# Altium schematic sheet 07 - USB Interface.SchDoc: USB Interface
size A3; Date:: 0; Page Number: 7; Page Size: B; Page Count: 12; Board Rev: B; Project Name: CrossLink-NX Evaluation Board; RevCode: 1.0; Doc: 305-PD-19-0819; DsnPath: C:\Users\HAltinkilit\Downloads\Crosslink-NX-Design-Files\CrossLink-NX-Eval-Brd-Schematic-RevB-191122.DSN; SchematicName: SCHEMATIC1; PageName: 03 - USB Interface; PageSize: B; TopSchematic: True
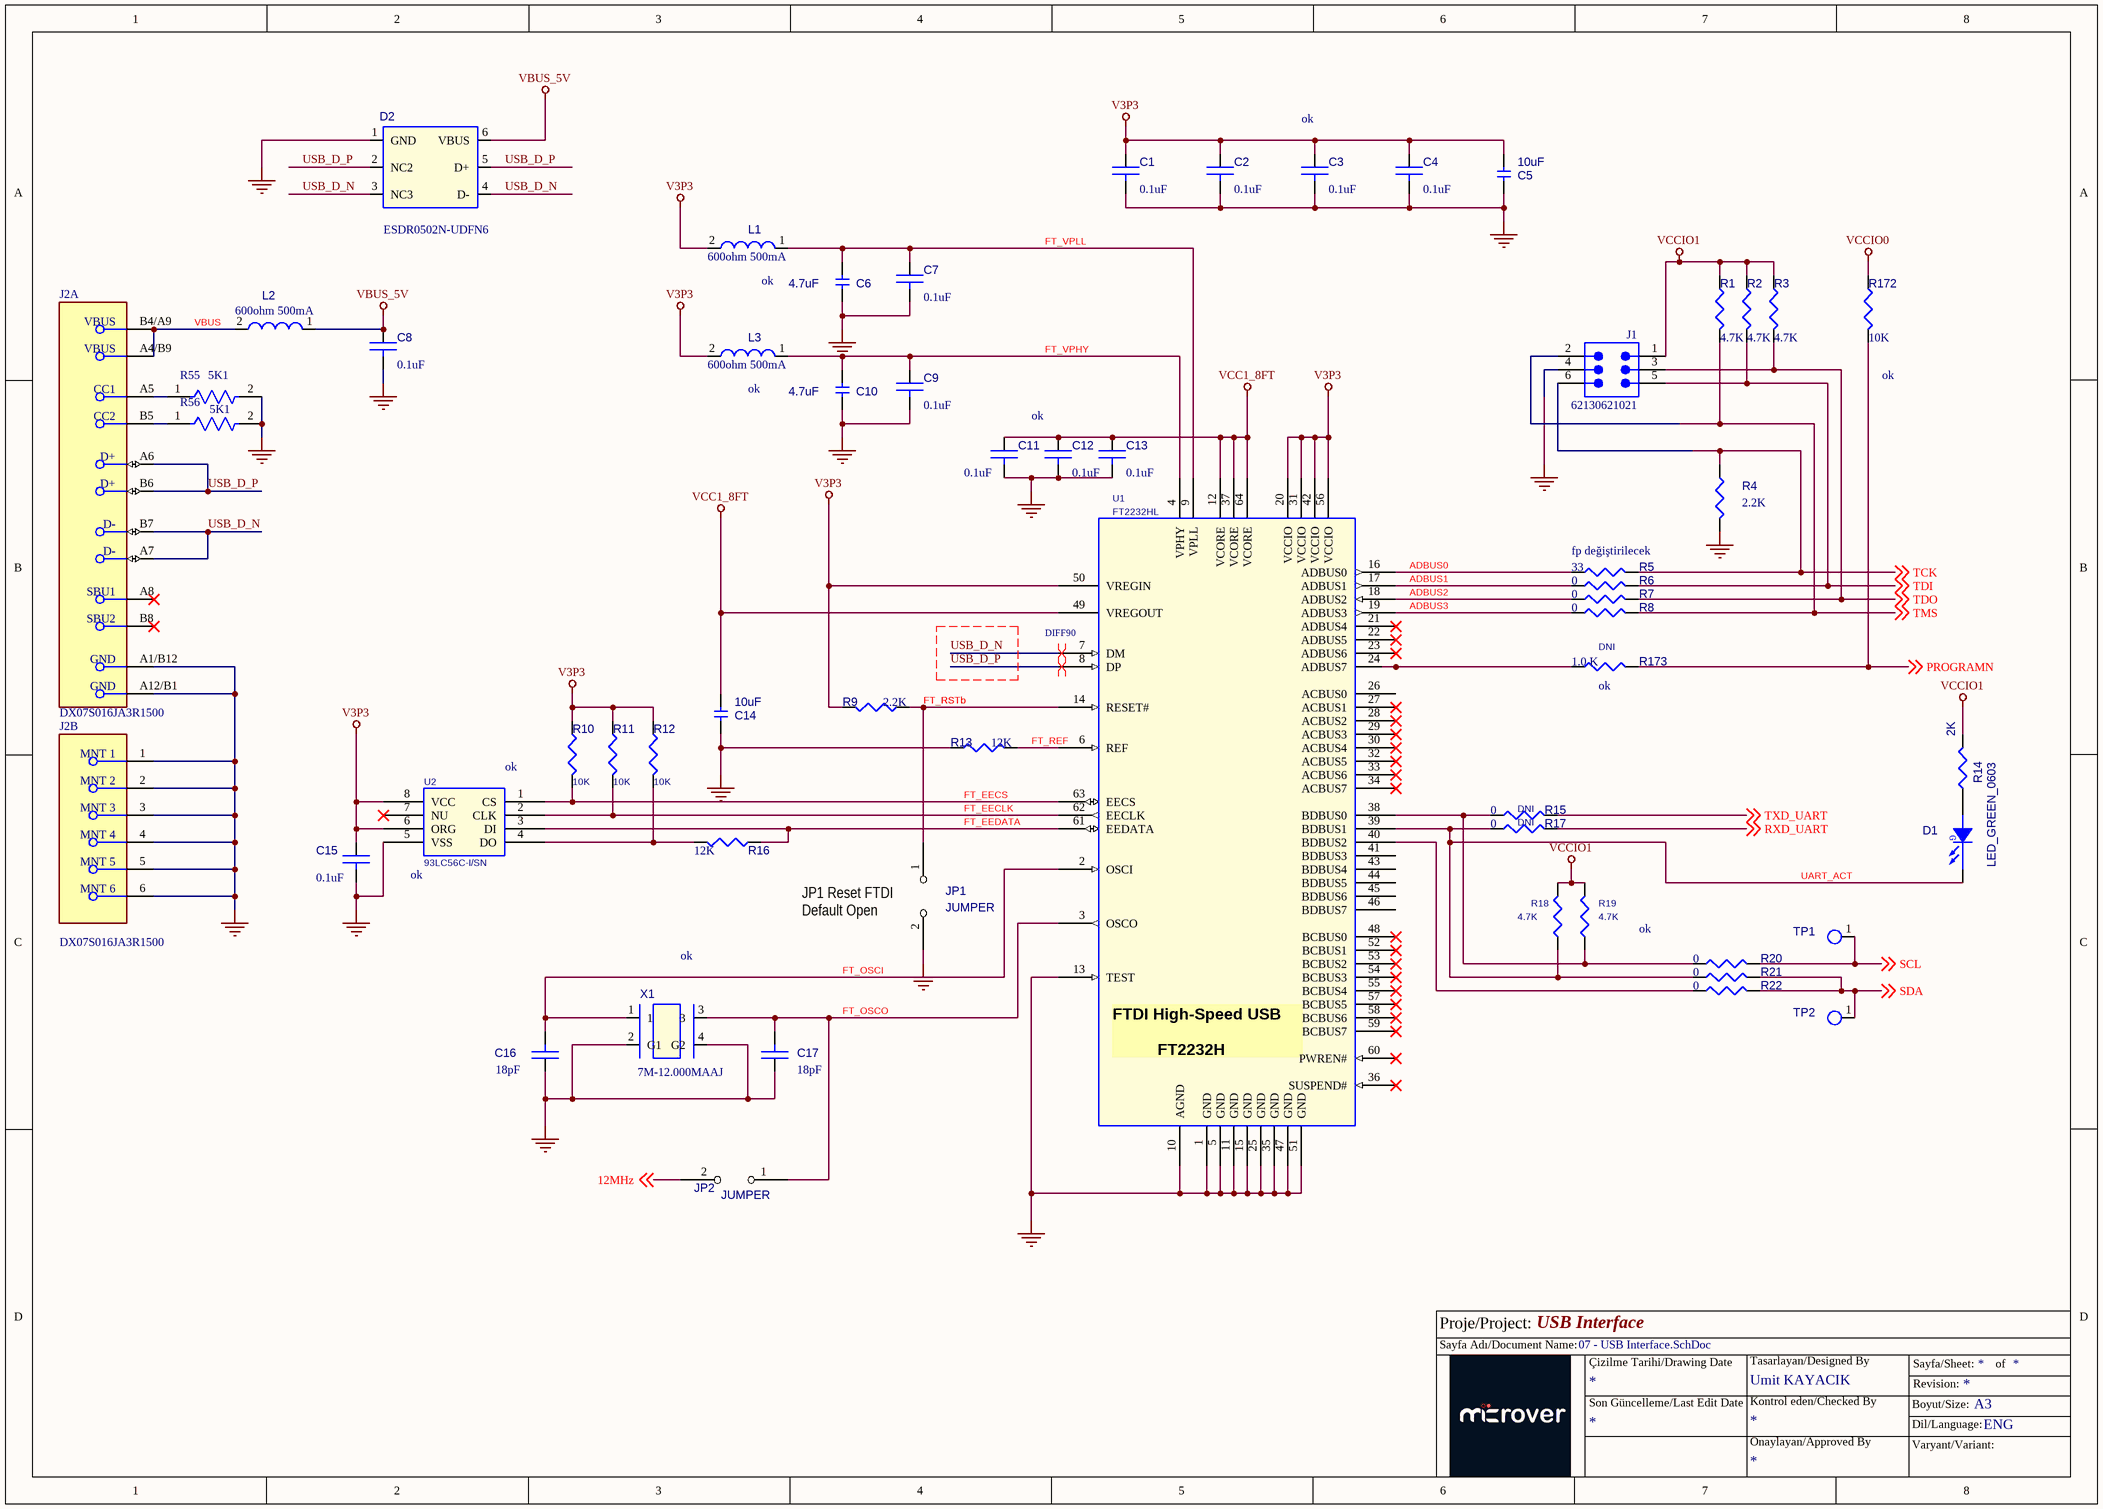
[diagram p0: 07 - USB Interface.SchDoc]

## Parts
C1  0.1uF  [C0201]
C2  0.1uF  [C0201]
C3  0.1uF  [C0201]
C4  0.1uF  [C0201]
C5  10uF  [C0603]
C6  4.7uF  [C0603]
C7  0.1uF  [C0201]
C8  0.1uF  [C0402]
C9  0.1uF  [C0201]
C10  4.7uF  [C0603]
C11  0.1uF  [C0201]
C12  0.1uF  [C0201]
C13  0.1uF  [c0201]
C14  10uF  [C0603]
C15  0.1uF  [C0201]
C16  18pF  [C0402]
C17  18pF  [C0402]
D1  LED_GREEN_0603  [APT1608]
D2  ESDR0502N-UDFN6  [UDFN6_040]
J1  62130621021  [62130621021]
J2  DX07S016JA3R1500  [FP-DX07S016JA3R1500-MFG]  (parts A,B of 2)
JP1  JUMPER  [R0603]
JP2  JUMPER  [0603]
L1  600ohm 500mA  [FB0603]
L2  600ohm 500mA  [FB0603]
L3  600ohm 500mA  [FB0603]
R1  4.7K  [R0603]
R2  4.7K  [R0603]
R3  4.7K  [R0603]
R4  2.2K  [R0603]
R5  33  [R0402]
R6  0  [R0603]
R7  0  [R0603]
R8  0  [R0603]
R9  2.2K  [R0603]
R10  10K  [R0603]
R11  10K  [R0603]
R12  10K  [R0603]
R13  12K  [R0603]
R14  2K  [R0402]
R15  0  Assy: DNI  [R0603]
R16  12K  [R0603]
R17  0  Assy: DNI  [R0603]
R18  4.7K  [RLP-101]
R19  4.7K  [RLP-101]
R20  0  [R0603]
R21  0  [R0603]
R22  0  [R0603]
R55  5K1  [FP-CR0402-IPC_A]
R56  5K1  [FP-CR0402-IPC_A]
R172  10K  [R0603]
R173  1.0 K  Assy: DNI  [R0603]
TP1  TP_S_40_63  [TP_1MM]  (value not drawn)
TP2  TP_S_40_63  [TP_1MM]  (value not drawn)
U1  FT2232HL  [tqfp64_0p5_12p2x12p2_h1p6]
U2  93LC56C-I/SN  [so8_50_244]
X1  7M-12.000MAAJ  [xtal_4p_7m]

## Nets
GND: C1.2 C2.2 C3.2 C4.2 C5.1 C6.1 C7.2 C8.2 C9.2 C10.1 C11.2 C12.2 C13.2 C14.1 C15.2 C16.1 C17.1 D2.1(GND) J1.4 J2.1(MNT_1) J2.2(MNT_2) J2.3(MNT_3) J2.4(MNT_4) J2.5(MNT_5) J2.6(MNT_6) J2.A1/B12(GND) J2.A12/B1(GND) JP1.2 R4.2 R13.1 R55.2 R56.2 U1.1(GND) U1.5(GND) U1.10(AGND) U1.11(GND) U1.13(TEST) U1.15(GND) U1.25(GND) U1.35(GND) U1.47(GND) U1.51(GND) U2.5(VSS) X1.2(G1) X1.4(G2)
V3P3: C1.1 C2.1 C3.1 C4.1 C5.2 C15.1 L1.2 L3.2 R9.2 R10.1 R11.1 R12.1 U1.20(VCCIO) U1.31(VCCIO) U1.42(VCCIO) U1.50(VREGIN) U1.56(VCCIO) U2.6(ORG) U2.8(VCC)
VBUS_5V: C8.1 D2.6(VBUS) L2.1
VCC1_8FT: C11.1 C12.1 C13.1 C14.2 U1.12(VCORE) U1.37(VCORE) U1.49(VREGOUT) U1.64(VCORE)
VCCIO0: R172.1
VCCIO1: J1.1 R1.1 R2.1 R3.1 R14.2 R18.2 R19.2
12MHz: JP2.2 ; off-sheet 12MHz
ADBUS0: R5.1 U1.16(ADBUS0)
ADBUS1: R6.1 U1.17(ADBUS1)
ADBUS2: R7.1 U1.18(ADBUS2)
ADBUS3: R8.1 U1.19(ADBUS3)
FT_EECLK: R11.2 U1.62(EECLK) U2.2(CLK)
FT_EECS: R10.2 U1.63(EECS) U2.1(CS)
FT_EEDATA: R16.1 U1.61(EEDATA) U2.3(DI)
FT_OSCI: C16.2 U1.2(OSCI) X1.1
FT_OSCO: C17.2 JP2.1 U1.3(OSCO) X1.3
FT_REF: R13.2 U1.6(REF)
FT_RSTb: JP1.1 R9.1 U1.14(RESET#)
FT_VPHY: C9.1 C10.2 L3.1 U1.4(VPHY)
FT_VPLL: C6.2 C7.1 L1.1 U1.9(VPLL)
PROGRAMN: R172.2 R173.2 ; off-sheet PROGRAMN
RXD_UART: R17.2 ; off-sheet RXD_UART
SCL: R20.2 TP1.1(TP) ; off-sheet SCL
SDA: R21.2 R22.2 TP2.1(TP) ; off-sheet SDA
TCK: J1.6 R4.1 R5.2 ; off-sheet TCK
TDI: J1.5 R2.2 R6.2 ; off-sheet TDI
TDO: J1.3 R3.2 R7.2 ; off-sheet TDO
TMS: J1.2 R1.2 R8.2 ; off-sheet TMS
TXD_UART: R15.2 ; off-sheet TXD_UART
UART_ACT: D1.1(CATHODE) R17.1 R18.1 R21.1 U1.39(BDBUS1)
USB_D_N: D2.3(NC3) D2.4(D-) J2.A7(D-) J2.B7(D-) U1.7(DM)
USB_D_P: D2.2(NC2) D2.5(D+) J2.A6(D+) J2.B6(D+) U1.8(DP)
VBUS: J2.A4/B9(VBUS) J2.B4/A9(VBUS) L2.2
NetD1_2: D1.2(ANODE) R14.1
NetJ2_A5: J2.A5(CC1) R55.1
NetJ2_B5: J2.B5(CC2) R56.1
NetR12_2: R12.2 R16.2 U2.4(DO)
NetR15_1: R15.1 R19.1 R20.1 U1.38(BDBUS0)
NetR22_1: R22.1 U1.40(BDBUS2)
NetR173_1: R173.1 U1.24(ADBUS7)

Not connected (* = marked no-connect by the designer): J2 A8(SBU1)* B8(SBU2)*; U1 21(ADBUS4)* 22(ADBUS5)* 23(ADBUS6)* 26(ACBUS0) 27(ACBUS1)* 28(ACBUS2)* 29(ACBUS3)* 30(ACBUS4)* 32(ACBUS5)* 33(ACBUS6)* 34(ACBUS7)* 36(SUSPEND#)* 41(BDBUS3) 43(BDBUS4) 44(BDBUS5) 45(BDBUS6) 46(BDBUS7) 48(BCBUS0)* 52(BCBUS1)* 53(BCBUS2)* 54(BCBUS3)* 55(BCBUS4)* 57(BCBUS5)* 58(BCBUS6)* 59(BCBUS7)* 60(PWREN#)*; U2 7(NU)*

## Layout directives
differential pair; differential pair class DIFF90: USB_D_N, USB_D_P

## Notes on the sheet
- (near C3) ok
- (near L1) ok
- (near R172) ok
- (near L3) ok
- ok
- (near R5) fp değiştirilecek
- (near R173) ok
- (near U2) ok
- (near JP1) JP1 Reset FTDI
  Default Open
- Proje/Project:
- Sayfa Adı/Document Name:
- Çizilme Tarihi/Drawing Date
- Umit KAYACIK
- Tasarlayan/Designed By
- Sayfa/Sheet:
- Revision:
- of
- Son Güncelleme/Last Edit Date
- Kontrol eden/Checked By
- Onaylayan/Approved By
- Boyut/Size:
- Varyant/Variant:
- Dil/Language:
- A3
- ENG
- (in symbol FT2232HL) FTDI High-Speed USB / FT2232H
- (in symbol LED-SMT1206_GREEN_1) G

## Library data of the parts
C1 = 0u1_0402: CAP CER 0.1UF 25V 10% X5R 0201; Manufacturer: Murata; Manufacturer Part Number: GRM033R61E104KE14J; Part Reference: C1; Class: Discrete; Digikey P/N: 399-3521-2-ND; Assy: -; Value: 0.1uF; PCB Footprint: C0201
C2 = 0u1_0402: CAP CER 0.1UF 25V 10% X5R 0201; Manufacturer: Murata; Manufacturer Part Number: GRM033R61E104KE14J; Part Reference: C2; Class: Discrete; Digikey P/N: 399-3521-2-ND; Assy: -; Value: 0.1uF; PCB Footprint: C0201
C3 = 0u1_0402: CAP CER 0.1UF 25V 10% X5R 0201; Manufacturer: Murata; Manufacturer Part Number: GRM033R61E104KE14J; Part Reference: C3; Class: Discrete; Digikey P/N: 399-3521-2-ND; Assy: -; Value: 0.1uF; PCB Footprint: C0201
C4 = 0u1_0402: CAP CER 0.1UF 25V 10% X5R 0201; Manufacturer: Murata; Manufacturer Part Number: GRM033R61E104KE14J; Part Reference: C4; Class: Discrete; Digikey P/N: 399-3521-2-ND; Assy: -; Value: 0.1uF; PCB Footprint: C0201
C5 = C: Part Reference: C5; DIST: FLAT; PSpiceTemplate: C^@REFDES %1 %2 ?TOLERANCE|C^@REFDES| @VALUE ?IC/IC=@IC/ ?TOLERANCE|\n.model C^@REFDES CAP C=1 DEV=@TOLERANCE%|; VOLTAGE: CMAX; CURRENT: CIMAX; KNEE: CBMAX; SLOPE: CSMAX; MAX_TEMP: CTMAX; Populate: <Populate>; Value: 10uF; Assy: -; PCB Footprint: C0603
C6 = C: Part Reference: C6; DIST: FLAT; PSpiceTemplate: C^@REFDES %1 %2 ?TOLERANCE|C^@REFDES| @VALUE ?IC/IC=@IC/ ?TOLERANCE|\n.model C^@REFDES CAP C=1 DEV=@TOLERANCE%|; VOLTAGE: CMAX; CURRENT: CIMAX; KNEE: CBMAX; SLOPE: CSMAX; MAX_TEMP: CTMAX; Populate: <Populate>; Value: 4.7uF; Assy: -; PCB Footprint: C0603
C7 = 0u1_0402: CAP CER 0.1UF 25V 10% X5R 0201; Manufacturer: Murata; Manufacturer Part Number: GRM033R61E104KE14J; Part Reference: C7; Class: Discrete; Digikey P/N: 399-3521-2-ND; Assy: -; Value: 0.1uF; PCB Footprint: C0201
C8 = 0u1_0402: CAP CER 0.1UF 25V 10% X5R 0201; Manufacturer: Murata; Manufacturer Part Number: GRM033R61E104KE14J; Part Reference: C8; Class: Discrete; PCB Footprint: C0201; Digikey P/N: 399-3521-2-ND; Assy: -; Value: 0.1uF
C9 = 0u1_0402: CAP CER 0.1UF 25V 10% X5R 0201; Manufacturer: Murata; Manufacturer Part Number: GRM033R61E104KE14J; Part Reference: C9; Class: Discrete; Digikey P/N: 399-3521-2-ND; Assy: -; Value: 0.1uF; PCB Footprint: C0201
C10 = C: Part Reference: C10; DIST: FLAT; PSpiceTemplate: C^@REFDES %1 %2 ?TOLERANCE|C^@REFDES| @VALUE ?IC/IC=@IC/ ?TOLERANCE|\n.model C^@REFDES CAP C=1 DEV=@TOLERANCE%|; VOLTAGE: CMAX; CURRENT: CIMAX; KNEE: CBMAX; SLOPE: CSMAX; MAX_TEMP: CTMAX; Populate: <Populate>; Value: 4.7uF; Assy: -; PCB Footprint: C0603
C11 = 0u1_0402: CAP CER 0.1UF 25V 10% X5R 0201; Manufacturer: Murata; Manufacturer Part Number: GRM033R61E104KE14J; Part Reference: C11; Class: Discrete; Digikey P/N: 399-3521-2-ND; Assy: -; Value: 0.1uF; PCB Footprint: C0201
C12 = 0u1_0402: CAP CER 0.1UF 25V 10% X5R 0201; Manufacturer: Murata; Manufacturer Part Number: GRM033R61E104KE14J; Part Reference: C12; Class: Discrete; Digikey P/N: 399-3521-2-ND; Assy: -; Value: 0.1uF; PCB Footprint: C0201
C13 = 0u1_0402: CAP CER 0.1UF 25V 10% X5R 0201; Manufacturer: Murata; Manufacturer Part Number: GRM033R61E104KE14J; Part Reference: C13; Class: Discrete; Digikey P/N: 399-3521-2-ND; Assy: -; Value: 0.1uF; PCB Footprint: C0201
C14 = C: Part Reference: C14; DIST: FLAT; PSpiceTemplate: C^@REFDES %1 %2 ?TOLERANCE|C^@REFDES| @VALUE ?IC/IC=@IC/ ?TOLERANCE|\n.model C^@REFDES CAP C=1 DEV=@TOLERANCE%|; VOLTAGE: CMAX; CURRENT: CIMAX; KNEE: CBMAX; SLOPE: CSMAX; MAX_TEMP: CTMAX; Populate: <Populate>; Value: 10uF; Assy: -; PCB Footprint: C0603
C15 = 0u1_0402: CAP CER 0.1UF 25V 10% X5R 0201; Manufacturer: Murata; Manufacturer Part Number: GRM033R61E104KE14J; Part Reference: C15; Class: Discrete; Digikey P/N: 399-3521-2-ND; Assy: -; Value: 0.1uF; PCB Footprint: C0201
C16 = 0u1_0402: CAP CER 18PF 25V 10% NP0 0402; Manufacturer: Kemet; Manufacturer Part Number: C0402C180K3GACTU; Part Reference: C16; Class: Discrete; Digikey P/N: C0402C180K3GACTU-ND; Assy: -; Value: 18pF; PCB Footprint: C0402
C17 = 0u1_0402: CAP CER 18PF 25V 10% NP0 0402; Manufacturer: Kemet; Manufacturer Part Number: C0402C180K3GACTU; Part Reference: C17; Class: Discrete; Digikey P/N: C0402C180K3GACTU-ND; Assy: -; Value: 18pF; PCB Footprint: C0402
D1 = LED-SMT1206_GREEN_1: Part Reference: D1; Value: LED_GREEN_0603; PCB Footprint: APT1608; Assy: -
D2 = ESDR0502: ESD Protection - SLP2510P8 package 8-PIN; Part Reference: D2; ALS LIB: L0000; CLASS: IC; Vendor: Digikey; MFG: Semtech; MFG P/N: RClamp0524P; Vendor P/N: RCLAMP0524PTR-ND; Value: ESDR0502N-UDFN6; PCB Footprint: UDFN6_040; Assy: -
J1 = CMP-1502-00936-4: Conn, Pin Hdr, 6POS, 2ROW, 1.27MM Rohs Compliant: Yes
J2 = CMP-19038-000002-1: CONN RCP USB2.0 TYP C 24P SMD RA
JP1 = JUMPER_0: Part Reference: JP1; PCB Footprint: Header_1x2; Value: JUMPER; Assy: -
JP2 = JUMPER_0: Part Reference: JP2; PCB Footprint: Header_1x2; Value: JUMPER; Assy: -
L1 = FB0603: FERRITE CHIP 600 OHM 500MA 0603; Manufacturer: Murata; Manufacturer Part Number: BLM18AG601SN1D; Part Reference: L1; Class: Discrete; Digikey P/N: 490-1014-1-ND; Value: 600ohm 500mA; PCB Footprint: fb0603; Assy: -
L2 = FB0603: FERRITE CHIP 600 OHM 500MA 0603; Manufacturer: Murata; Manufacturer Part Number: BLM18AG601SN1D; Part Reference: L2; Class: Discrete; Digikey P/N: 490-1014-1-ND; Value: 600ohm 500mA; PCB Footprint: fb0603; Assy: -
L3 = FB0603: FERRITE CHIP 600 OHM 500MA 0603; Manufacturer: Murata; Manufacturer Part Number: BLM18AG601SN1D; Part Reference: L3; Class: Discrete; Digikey P/N: 490-1014-1-ND; Value: 600ohm 500mA; PCB Footprint: fb0603; Assy: -
R1 = 5k1_0402: RES 4.70K OHM 1/10W 1% 0603 SMD; Manufacturer Part Number: CRCW06034K70FKEA; Manufacturer: Vishay; Part Reference: R1; Class: Discrete; Digikey P/N: 541-4.70KHTR-ND; Assy: -; Value: 4.7K; PCB Footprint: R0603
R2 = 5k1_0402: RES 4.70K OHM 1/10W 1% 0603 SMD; Manufacturer Part Number: CRCW06034K70FKEA; Manufacturer: Vishay; Part Reference: R2; Class: Discrete; Digikey P/N: 541-4.70KHTR-ND; Assy: -; Value: 4.7K; PCB Footprint: R0603
R3 = 5k1_0402: RES 4.70K OHM 1/10W 1% 0603 SMD; Manufacturer Part Number: CRCW06034K70FKEA; Manufacturer: Vishay; Part Reference: R3; Class: Discrete; Digikey P/N: 541-4.70KHTR-ND; Assy: -; Value: 4.7K; PCB Footprint: R0603
R4 = 5k1_0402: Manufacturer Part Number: CRCW06032K20FKEA; Manufacturer: Vishay; Part Reference: R4; Class: Discrete; Digikey P/N: 541-2.20KHTR-ND; Assy: -; Value: 2.2K; PCB Footprint: R0603
R5 = 0R_0603: RES SMD 33 OHM 1% 1/10W 0402; Manufacturer: Panasonic; Manufacturer Part Number: ERJ-2RKF33R0X; Part Reference: R5; Class: Discrete; Digikey P/N: 311-0.0GRTR-ND; Assy: -; Value: 33; PCB Footprint: R0402
R6 = 0R_0603: RES 0.0 OHM 1/10W JUMP 0603 SMD; Manufacturer: Yageo; Manufacturer Part Number: RC0603JR-070RL; Part Reference: R6; Class: Discrete; Digikey P/N: 311-0.0GRTR-ND; Assy: -; Value: 0; PCB Footprint: R0603
R7 = 0R_0603: RES 0.0 OHM 1/10W JUMP 0603 SMD; Manufacturer: Yageo; Manufacturer Part Number: RC0603JR-070RL; Part Reference: R7; Class: Discrete; Digikey P/N: 311-0.0GRTR-ND; Assy: -; Value: 0; PCB Footprint: R0603
R8 = 0R_0603: RES 0.0 OHM 1/10W JUMP 0603 SMD; Manufacturer: Yageo; Manufacturer Part Number: RC0603JR-070RL; Part Reference: R8; Class: Discrete; Digikey P/N: 311-0.0GRTR-ND; Assy: -; Value: 0; PCB Footprint: R0603
R9 = 5k1_0402: Manufacturer Part Number: CRCW06032K20FKEA; Manufacturer: Vishay; Part Reference: R9; Class: Discrete; Digikey P/N: 541-2.20KHTR-ND; Assy: -; Value: 2.2K; PCB Footprint: R0603
R10 = RES_10K_1W16_0402_5P: RES 10K OHM 1/10W 5% 0603; Part Reference: R10; Manufacturer Part Number: RMCF0603JT10K0; Unit Price (USD): 0.02; Total Area(sq-mm): 0.5; DIST: FLAT; MAX_TEMP: RTMAX; MFG P/N: RMCF0402JT10K0; MFG: Stackpole Electronics Inc; TC1: 0; Length(mm): 1; Width(mm): 0.5; Wattage: 1/10W; TC2: 0; Value: 10K; PCB Footprint: R0603; Manufacturer: Stackpole Electronics Inc; Digikey P/N: RMCF0603JT10K0TR-ND; Assy: -
R11 = RES_10K_1W16_0402_5P: RES 10K OHM 1/10W 5% 0603; Part Reference: R11; Manufacturer Part Number: RMCF0603JT10K0; Unit Price (USD): 0.02; Total Area(sq-mm): 0.5; DIST: FLAT; MAX_TEMP: RTMAX; MFG P/N: RMCF0402JT10K0; MFG: Stackpole Electronics Inc; TC1: 0; Length(mm): 1; Width(mm): 0.5; Wattage: 1/10W; TC2: 0; Value: 10K; PCB Footprint: R0603; Digikey P/N: RMCF0603JT10K0TR-ND; Manufacturer: Stackpole Electronics Inc; Assy: -
R12 = RES_10K_1W16_0402_5P: RES 10K OHM 1/10W 5% 0603; Part Reference: R12; Manufacturer Part Number: RMCF0603JT10K0; Unit Price (USD): 0.02; Total Area(sq-mm): 0.5; DIST: FLAT; MAX_TEMP: RTMAX; MFG P/N: RMCF0402JT10K0; MFG: Stackpole Electronics Inc; TC1: 0; Length(mm): 1; Width(mm): 0.5; Wattage: 1/10W; TC2: 0; Value: 10K; PCB Footprint: R0603; Digikey P/N: RMCF0603JT10K0TR-ND; Manufacturer: Stackpole Electronics Inc; Assy: -
R13 = 10k_0402: RES 12K OHM 1/10W 1% 0603 SMD; Manufacturer: Yageo; Manufacturer Part Number: RC0603FR-0712KL; Part Reference: R13; Class: Discrete; Assy: -; Digikey P/N: 311-12.0KHRTR-ND; Value: 12K; PCB Footprint: R0603; Tolerance: 1%
R14 = RES_0: Part Reference: R14; PCB Footprint: RLP-101; Value: 2K; Assy: -
R15 = 0R_0603: Res 1/10W 0.0 Ohm 5% 0603; Manufacturer: Yageo; Manufacturer Part Number: RC0603JR-070RL; Part Reference: R15; Class: Discrete; Digikey P/N: 311-0.0GRTR-ND; Value: 0; PCB Footprint: R0603
R16 = 10k_0402: RES 12K OHM 1/10W 1% 0603 SMD; Manufacturer: Yageo; Manufacturer Part Number: RC0603FR-0712KL; Part Reference: R16; Class: Discrete; Assy: -; Digikey P/N: 311-12.0KHRTR-ND; Value: 12K; PCB Footprint: R0603; Tolerance: 1%
R17 = 0R_0603: Res 1/10W 0.0 Ohm 5% 0603; Manufacturer: Yageo; Manufacturer Part Number: RC0603JR-070RL; Part Reference: R17; Class: Discrete; Digikey P/N: 311-0.0GRTR-ND; Value: 0; PCB Footprint: R0603
R18 = RESISTOR: Part Reference: R18; Populate: <Populate>; Value: 4.7K; ASSY: -; PCB Footprint: RLP-101
R19 = RESISTOR: Part Reference: R19; Populate: <Populate>; Value: 4.7K; ASSY: -; PCB Footprint: RLP-101
R20 = 0R_0603: RES 0.0 OHM 1/10W JUMP 0603 SMD; Manufacturer: Yageo; Manufacturer Part Number: RC0603JR-070RL; Part Reference: R20; Class: Discrete; Digikey P/N: 311-0.0GRTR-ND; Assy: -; Value: 0; PCB Footprint: R0603
R21 = 0R_0603: RES 0.0 OHM 1/10W JUMP 0603 SMD; Manufacturer: Yageo; Manufacturer Part Number: RC0603JR-070RL; Part Reference: R21; Class: Discrete; Digikey P/N: 311-0.0GRTR-ND; Assy: -; Value: 0; PCB Footprint: R0603
R22 = 0R_0603: RES 0.0 OHM 1/10W JUMP 0603 SMD; Manufacturer: Yageo; Manufacturer Part Number: RC0603JR-070RL; Part Reference: R22; Class: Discrete; Digikey P/N: 311-0.0GRTR-ND; Assy: -; Value: 0; PCB Footprint: R0603
R55 R56 = CMP-2002-05251-2: Thick Film Chip Resistors 0402 5.1kΩ 0.0625W 1% 100ppm/°C; Resistance: 5.1kR; Max Power Dissipation: 63mW; Voltage Rating: 50V; Power Rating: 62.5mW; Case Code (Imperial): 0402; Composition: Thick Film; Packaging: Tape and Reel; Min Operating Temperature: -55°C; Depth: 0.5mm; Tolerance: 1%; Temperature Coefficient: 100ppm/°C; Contact Plating: Tin; Thickness: 356um; Package Quantity: 10000; Military Standard: Not; Case/Package: 0402; Mount: Surface Mount; Max Operating Temperature: 125°C; Length: 1mm; Height: 0.016inch; Width: 0.02inch; Number of Terminations: 2; Radiation Hardening: No; Case Code (Metric): 1005; Termination: SMD/SMT
R172 = 5k1_0402: RES SMD 10K OHM 1% 1/10W 0603; Manufacturer Part Number: RC0603FR-0710KL; Manufacturer: Yageo; Part Reference: R172; Class: Discrete; Digikey P/N: 541-4.70KHTR-ND; Assy: -; Value: 10K; PCB Footprint: R0603
R173 = 0R_0603: RES SMD 1K OHM 1% 1/10W 0603; Manufacturer: Yageo; Manufacturer Part Number: RC0603FR-071KL; Part Reference: R173; Class: Discrete; Digikey P/N: 311-0.0GRTR-ND; Value: 1.0 K; PCB Footprint: R0603
TP1 = TP_S_40_63: Square test point, 40mil inner diameter, 63mil outer diameter; Part Reference: TP1; Assy: DNI; Class: IO; PCB Footprint: TP; Value: TP_S_40_63
TP2 = TP_S_40_63: Square test point, 40mil inner diameter, 63mil outer diameter; Part Reference: TP2; Assy: DNI; Class: IO; PCB Footprint: TP; Value: TP_S_40_63
U1 = FT2232HL: IC USB HS DUAL UART/FIFO 64-LQFP; Manufacturer: FTDI; Part Reference: U1; Assy: Customer Supplied; Class: IC; Manufacturer Part Number: FT2232HL; Digikey P/N: 768-1024-1-ND; Value: FT2232HL; PCB Footprint: tqfp64_0p5_12p2x12p2_h1p6
U2 = 93LC56_SO8_0: IC EEPROM 2KBIT 3MHZ 8SOIC; Manufacturer: Microchip; Part Reference: U2; Digikey P/N: 93LC56C-I/SN-ND; Manufacturer Part Number: 93LC56C-I/SN; Class: IC; Value: 93LC56C-I/SN; PCB Footprint: so8_50_244; Assy: -
X1 = crystal-3p2x2p5: CRYSTAL 12MHZ 18PF SMD; Manufacturer Part Number: 7M-12.000MAAJ-T; Manufacturer: TXC; Part Reference: X1; Class: IC; Digikey P/N: 887-1121-2-ND; Value: 7M-12.000MAAJ; PCB Footprint: xtal_4p_7m; Assy: -